# EAGLE schematic avr_g1000r_24 (EAGLE 9.4.0)
v21: testpoints
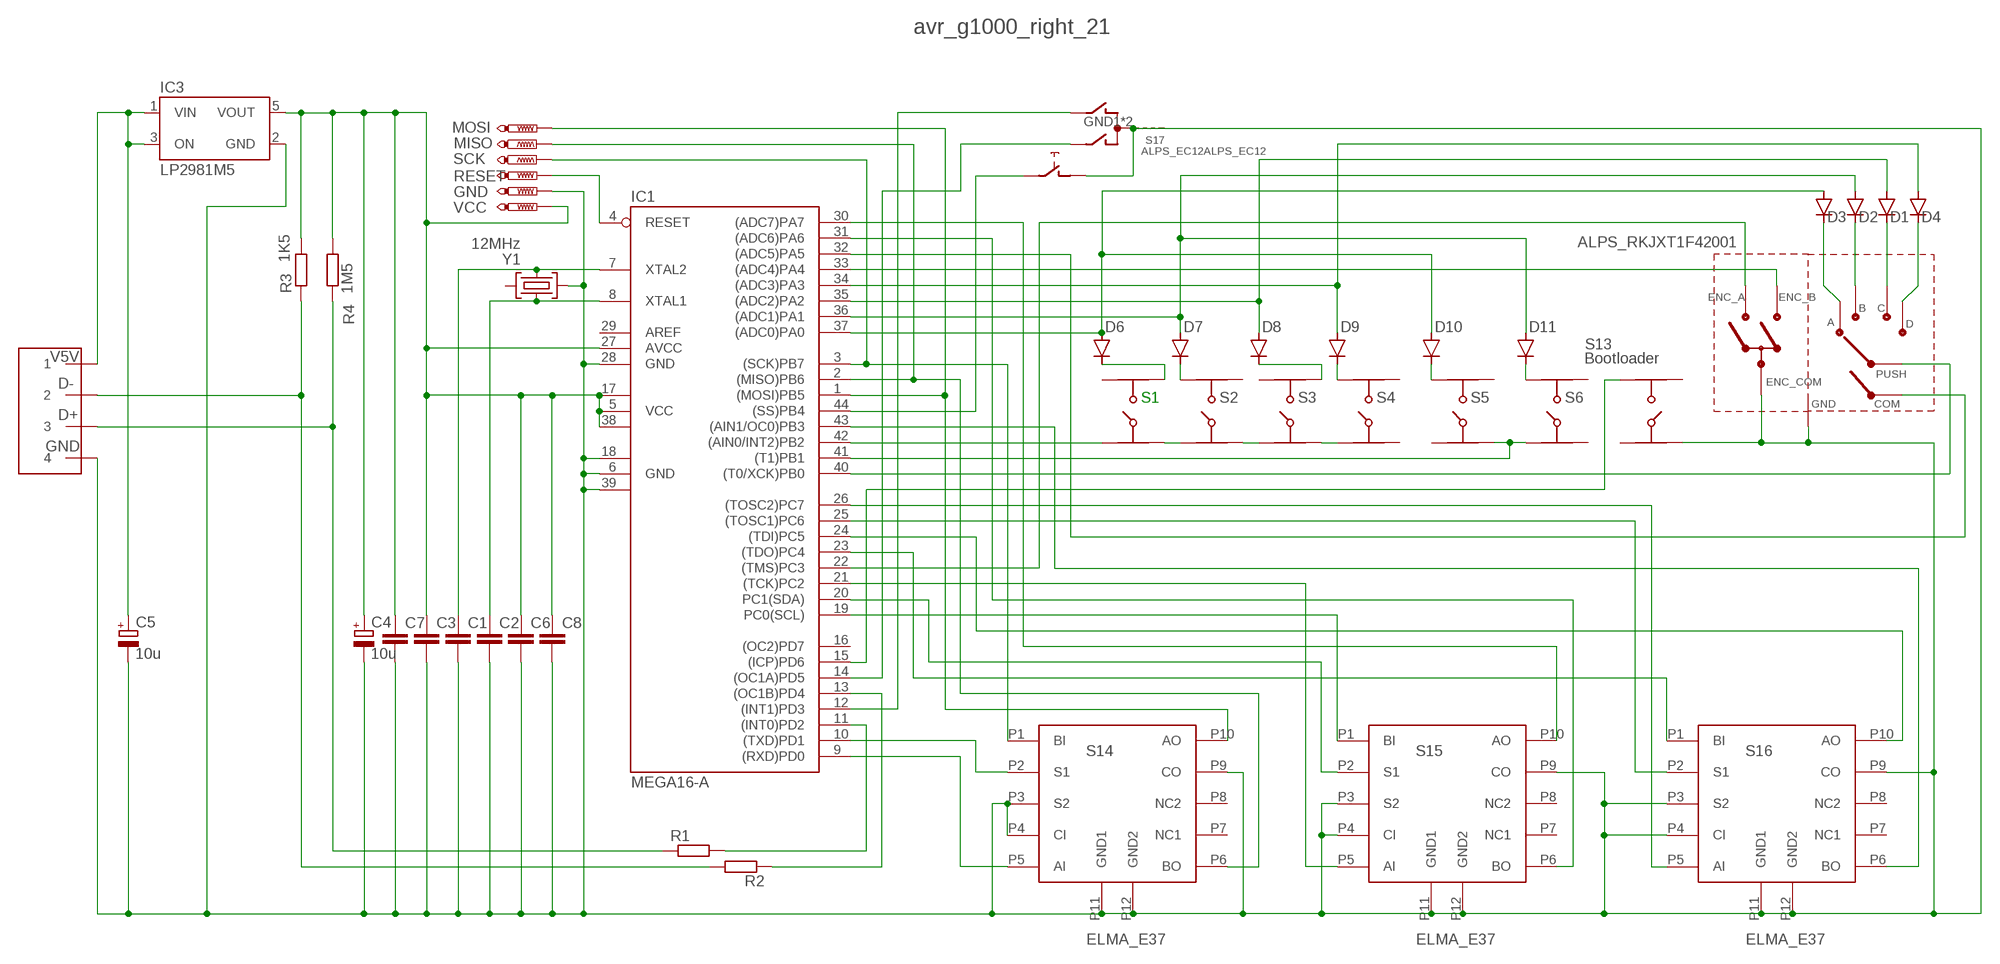
[diagram p0: schematic, sheet 1]

## Parts
C1  C-EUC0402  [C0402]
C2  C-EUC0402  [C0402]
C3  C-EUC0402  [C0402]
C4  10u  CPOL-EUSMCA  [SMC_A]
C5  10u  CPOL-EUSMCA  [SMC_A]
C6  C-EUC0402  [C0402]
C7  C-EUC0402  [C0402]
C8  C-EUC0402  [C0402]
D1  DIODE-SOD123  [SOD123]
D2  DIODE-SOD123  [SOD123]
D3  DIODE-SOD123  [SOD123]
D4  DIODE-SOD123  [SOD123]
D6  DIODE-SOD123  [SOD123]
D7  DIODE-SOD123  [SOD123]
D8  DIODE-SOD123  [SOD123]
D9  DIODE-SOD123  [SOD123]
D10  DIODE-SOD123  [SOD123]
D11  DIODE-SOD123  [SOD123]
GND  PTR1TP10R  [TP10R]
IC1  MEGA16-A  [TQFP44]
IC3  LP2981M5  [SOT23-5]
MISO  PTR1TP10R  [TP10R]
MOSI  PTR1TP10R  [TP10R]
R1  R-EU_R0603  [R0603]
R2  R-EU_R0603  [R0603]
R3  1K5  R-EU_R0603  [R0603]
R4  1M5  R-EU_R0603  [R0603]
RESET  PTR1TP10R  [TP10R]
S1  B3FS1000  [B3FS1000]
S2  B3FS1000  [B3FS1000]
S3  B3FS1000  [B3FS1000]
S4  B3FS1000  [B3FS1000]
S5  B3FS1000  [B3FS1000]
S6  B3FS1000  [B3FS1000]
S7  RKJXT1F42001  [RKJXT1F42001]
S13  Bootloader  B3FS1000  [B3FS1000]
S14  ELMA_E37  [ELMA_E37]
S15  ELMA_E37  [ELMA_E37]
S16  ELMA_E37  [ELMA_E37]
S17  ALPS_EC12ALPS_EC12  [ALPS_EC12E_SW]
SCK  PTR1TP10R  [TP10R]
U$4  HEADER4X1.27  [HEADER4X1.27]
VCC  PTR1TP10R  [TP10R]
Y1  12MHz  MJ-CRYSTALMJ  [OSCCC500X320X100]

## Nets
D1: D1.C S7.C
D2: D2.C S7.B
D3: D3.C S7.A
D4: D4.C S7.D
D7: D7.C S2.1
D8: D8.C S3.2
D10: D10.C S5.1
D11: D11.C S6.1
D+: R1.1 R4.1 U$4.P3
D-: R2.2 R3.1 U$4.P2
GND [GND]: C1.2 C2.2 C3.2 C4.- C5.- C6.2 C7.2 C8.2 GND.TP IC1.6(GND) IC1.18(GND1) IC1.28(GND) IC1.39(GND2) IC3.2(GND) S7.ENC_COM S7.GND S13.3 S14.P3(S2) S14.P4(CI) S14.P9(CO) S14.P11(GND1) S14.P12(GND2) S15.P3(S2) S15.P4(CI) S15.P9(CO) S15.P11(GND1) S15.P12(GND2) S16.P3(S2) S16.P4(CI) S16.P9(CO) S16.P11(GND1) S16.P12(GND2) S17.C S17.D S17.GND1(G) S17.GND2(G) U$4.P4 Y1.2(GND1)
N$1: D9.C S4.1
N$5: IC1.21((TCK)PC2) S15.P5(AI)
N$6: D6.C S1.2
PA0: D3.A D6.A D10.A IC1.37((ADC0)PA0)
PA1: D2.A D7.A D11.A IC1.36((ADC1)PA1)
PA2: D1.A D8.A IC1.35((ADC2)PA2)
PA3: D4.A D9.A IC1.34((ADC3)PA3)
PA4: IC1.33((ADC4)PA4) S7.ENC_B
PA5: IC1.32((ADC5)PA5) S7.COM
PA6: IC1.31((ADC6)PA6) S15.P6(BO)
PA7: IC1.30((ADC7)PA7) S15.P10(AO)
PB0: IC1.40((T0/XCK)PB0) S7.PUSH
PB1: IC1.41((T1)PB1) S5.4 S6.3
PB2: IC1.42((AIN0/INT2)PB2) S1.3 S1.4 S2.3 S2.4 S3.3 S3.4 S4.3
PB3: IC1.43((AIN1/OC0)PB3) S16.P6(BO)
PB4: IC1.44((SS)PB4) S17.E
PB5: IC1.1((MOSI)PB5) MOSI.TP S14.P10(AO)
PB6: IC1.2((MISO)PB6) MISO.TP S14.P6(BO)
PB7: IC1.3((SCK)PB7) S14.P1(BI) SCK.TP
PC0: IC1.19(PC0(SCL)) S15.P1(BI)
PC1: IC1.20(PC1(SDA)) S15.P2(S1)
PC3: IC1.22((TMS)PC3) S7.ENC_A
PC4: IC1.23((TDO)PC4) S16.P1(BI)
PC5: IC1.24((TDI)PC5) S16.P10(AO)
PC6: IC1.25((TOSC1)PC6) S16.P2(S1)
PC7: IC1.26((TOSC2)PC7) S16.P5(AI)
PD0: IC1.9((RXD)PD0) S14.P5(AI)
PD1: IC1.10((TXD)PD1) S14.P2(S1)
PD2: IC1.11((INT0)PD2) R1.2
PD3: IC1.12((INT1)PD3) S17.B
PD4: IC1.13((OC1B)PD4) R2.1
PD5: IC1.14((OC1A)PD5) S17.A
PD6: IC1.15((ICP)PD6) S13.2
RESET: IC1.4(RESET) RESET.TP
V5V: C5.+ IC3.1(VIN) IC3.3(ON) U$4.P1
VCC: C3.1 C4.+ C6.1 C7.1 C8.1 IC1.5(VCC) IC1.17(VCC1) IC1.27(AVCC) IC1.38(VCC2) IC3.5(VOUT) R3.2 R4.2 VCC.TP
XTAL1: C2.1 IC1.8(XTAL1) Y1.3(CRYSTAL2)
XTAL2: C1.1 IC1.7(XTAL2) Y1.1(CRYSTAL1)
Unconnected: IC1.16((OC2)PD7) IC1.29(AREF) S1.1 S2.2 S3.1 S4.2 S4.4 S5.2 S5.3 S6.2 S6.4 S13.1 S13.4 S14.P7(NC1) S14.P8(NC2) S15.P7(NC1) S15.P8(NC2) S16.P7(NC1) S16.P8(NC2) Y1.4(GND2)

## Notes on the sheet
- avr_g1000_right_21
- ALPS_RKJXT1F42001

## Library data of the parts
C1-C3 C6-C8 = rcl:C-EU: CAPACITOR, European symbol; SPICEPREFIX: C
C4 C5 = rcl:CPOL-EU: POLARIZED CAPACITOR, European symbol; SPICEPREFIX: C
D1-D4 D6-D11 = diode:DIODE-: DIODE; SPICEPREFIX: D
GND MISO MOSI RESET SCK VCC = testpad:PTR1: TEST PIN
IC1 = atmel:MEGA16: MICROCONTROLLER 16 Kbytes FLASH 1 kbytes SRAM 512 bytes EEPROM USART 8-channel 10 bit ADC Source: avr.lbr; MPN: ATMEGA16-16AU; OC_FARNELL: 9171134; OC_NEWARK: 96K6515
IC3 = v-reg-3:LP2981: National Semiconductor <http://www.national.com> Micropower Linear Regulator 100mA regulated output, Vin 16V max., ultra-low dropout of 200mV @ 100mA, 1µA standby current
R1-R4 = rcl:R-EU_: RESISTOR, European symbol; SPICEPREFIX: R
S1 = omron b3fs1000:B3FS1000; SPICEPREFIX: S
S2-S6 S13 = omron b3fs1000:B3FS1000
S7 = RKJXT1F42001:RKJXT1F42001
S14-S16 = elma e37:ELMA_E37
S17 = alps_ec12:ALPS_EC12
U$4 = header4x1.27:HEADER4X1.27
Y1 = euroquartz:MJ-CRYSTAL: Miniature size: 5.0mm x 3.2mm x 1.0mm height

## Net classes
0 default: width 0.15 mm, clearance 0.15 mm
1 GND: width 0.3 mm, clearance 0.15 mm
2 VCC: width 0.3 mm, clearance 0.15 mm